# Altium schematic sheet AT long bus (13.3 x 4.2 inches).schdoc: AT long bus (13.3 x 4.2 inches)
size A; Organization: Organization; Address1: Address1; Address2: Address2; Address3: Address3; Address4: Address4; DocumentNumber: 1; Revision: 0; SheetNumber: 2; SheetTotal: 2
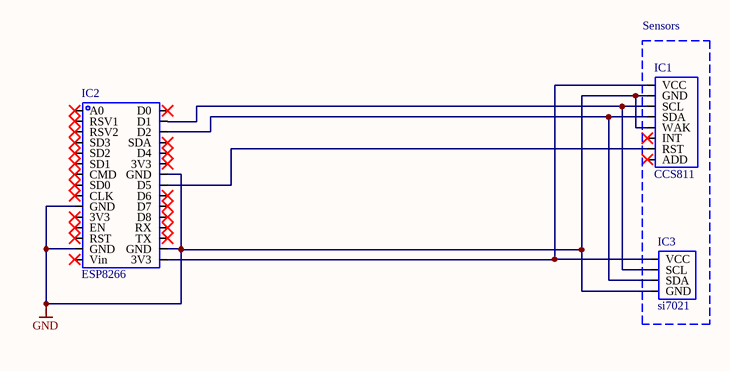
[diagram p0: AT long bus (13.3 x 4.2 inches).schdoc]

## Parts
IC1  CCS811  [CCS811]
IC2  ESP8266  [ESP8266]
IC3  si7021  [is7021]

## Blocks framed on the sheet
Sensors: IC1 IC3

## Nets
GND: IC1.2(GND) IC1.5(WAK) IC2.10(GND) IC2.15(GND) IC2.17(GND) IC2.24(GND) IC3.4(GND)
NetIC1_1: IC1.1(VCC) IC2.16(3V3) IC3.1(VCC)
NetIC1_3: IC1.3(SCL) IC2.29(D1) IC3.2(SCL)
NetIC1_4: IC1.4(SDA) IC2.28(D2) IC3.3(SDA)
NetIC1_7: IC1.7(RST) IC2.23(D5)

Not connected (* = marked no-connect by the designer): IC1 6(INT)* 8(ADD)*; IC2 1(A0)* 2(RSV1)* 3(RSV2)* 4(SD3)* 5(SD2)* 6(SD1)* 7(CMD)* 8(SD0)* 9(CLK)* 11(3V3)* 12(EN)* 13(RST)* 18(TX)* 19(RX)* 20(D8)* 21(D7)* 22(D6)* 25(3V3)* 26(D4)* 27(SDA)* 30(D0)*